# Altium schematic sheet Power.SchDoc
size A4; SheetNumber: 1; SheetTotal: 3
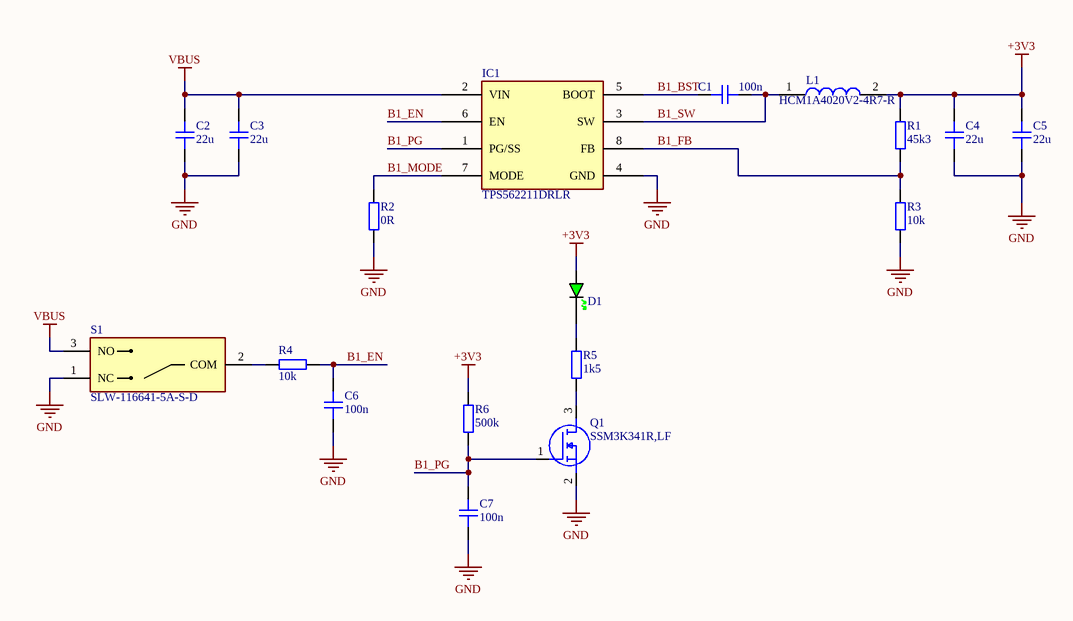
[diagram p0: Power.SchDoc]

## Parts
C1  100n  [CAP_0402]
C2  22u  [CAP_0603]
C3  22u  [CAP_0603]
C4  22u  [CAP_0603]
C5  22u  [CAP_0603]
C6  100n  [CAP_0402]
C7  100n  [CAP_0402]
D1  GREEN  [LED_0603_GREEN]  (value not drawn)
IC1  TPS562211DRLR  [SOTFL50P160X60-8N]
L1  HCM1A4020V2-4R7-R  [INDPM4442X200N]
Q1  SSM3K341R,LF  [SOTFL95P240X88-3N]
R1  45k3  [RES_0402]
R2  0R  [RES_0402]
R3  10k  [RES_0402]
R4  10k  [RES_0402]
R5  1k5  [RES_0603]
R6  500k  [RES_0402]
S1  SLW-116641-5A-S-D  [SLW1166415ASD]

## Nets
+3V3: C4.2 C5.2 D1.A L1.2 R1.2 R6.2
GND: C2.1 C3.1 C4.1 C5.1 C6.2 C7.2 IC1.4(GND) Q1.2(S) R2.1 R3.1 S1.1(NC)
VBUS: C2.2 C3.2 IC1.2(VIN) S1.3(NO)
B1_BST: C1.2 IC1.5(BOOT)
B1_EN: C6.1 IC1.6(EN) R4.1
B1_FB: IC1.8(FB) R1.1 R3.2
B1_MODE: IC1.7(MODE) R2.2
B1_PG: C7.1 IC1.1(PG/SS) Q1.1(G) R6.1
B1_SW: C1.1 IC1.3(SW) L1.1
NetD1_K: D1.K R5.2
NetQ1_3: Q1.3(D) R5.1
NetR4_2: R4.2 S1.2(COM)

## Library data of the parts
C1 C6 C7 = CAP_0402: Capacitor SMD 0402; Manufacturer: *; Manufacturer Part Number: *; Distributor Link: *; LCSC: *; Rating: *; Dielectric: *
C2-C5 = CAP_0603: Capacitor SMD 0603; Manufacturer: *; Manufacturer Part Number: *; Distributor Link: *; LCSC: *; Rating: *; Dielectric: *
D1 = LED_0603_GREEN: LED 0603 GREEN SMD
IC1 = TPS562211DRLR: Integrated Circuit; Manufacturer_Name: Texas Instruments; Datasheet Link: https://www.ti.com/lit/gpn/tps562211?HQS=ti-null-null-sf-df-pf-sep-wwe&DCM=yes; Height: 0.6mm; Manufacturer_Part_Number: TPS562211DRLR; Mouser Part Number: 595-TPS562211DRLR; Mouser Price/Stock: https://www.mouser.co.uk/ProductDetail/Texas-Instruments/TPS562211DRLR?qs=QNEnbhJQKvbGZDTBa5sjbg%3D%3D
L1 = HCM1A4020V2-4R7-R: Inductor; Manufacturer_Name: Eaton; Datasheet Link: https://www.eaton.com/content/dam/eaton/products/electronic-components/resources/data-sheet/eaton-hcm1a4020v2-automotive-power-inductor-data-sheet.pdf; Height: 2mm; Manufacturer_Part_Number: HCM1A4020V2-4R7-R; Mouser Part Number: 504-HCM1A4020V24R7-R; Mouser Price/Stock: https://www.mouser.co.uk/ProductDetail/Coiltronics-Eaton/HCM1A4020V2-4R7-R?qs=XeJtXLiO41Tld1UV9xSCUQ%3D%3D; Arrow Part Number: HCM1A4020V2-4R7-R; Arrow Price/Stock: https://www.arrow.com/en/products/hcm1a4020v2-4r7-r/eaton?region=nac
Q1 = SSM3K341R,LF: MOSFET (N-Channel); Manufacturer_Name: Toshiba; Datasheet Link: https://toshiba.semicon-storage.com/info/docget.jsp?did=35714&prodName=SSM3K341R; Height: 0.88mm; Manufacturer_Part_Number: SSM3K341R,LF; Mouser Part Number: 757-SSM3K341RLF; Mouser Price/Stock: https://www.mouser.co.uk/ProductDetail/Toshiba/SSM3K341RLF?qs=PDgMCp4xDJYlECuIdOFceQ%3D%3D; Arrow Part Number: SSM3K341R,LF; Arrow Price/Stock: https://www.arrow.com/en/products/ssm3k341rlf/toshiba?region=nac
R1-R4 R6 = RES_0402: Resistor SMD 0402; Manufacturer: *; Manufacturer Part Number: *; Distributor Link: *; LCSC: *
R5 = RES_0603: Resistor SMD 0603; Manufacturer: *; Manufacturer Part Number: *; Distributor Link: *; LCSC: *
S1 = SLW-116641-5A-S-D: Switch; Manufacturer_Name: Same Sky; Datasheet Link: https://www.sameskydevices.com/product/resource/supplyframepdf/slw-116641-5a-s-d.pdf; Height: 11.3mm; Manufacturer_Part_Number: SLW-116641-5A-S-D; Mouser Part Number: 179-SLW1166415ASD; Mouser Price/Stock: https://www.mouser.co.uk/ProductDetail/Same-Sky/SLW-116641-5A-S-D?qs=IKkN%2F947nfBZSdW8n5Vqgw%3D%3D